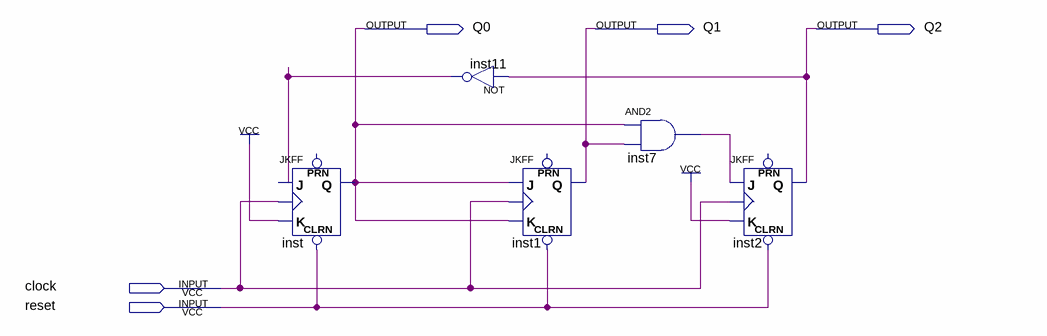
[diagram p0: schematic sheet]
// Quartus schematic Numaratormodulo5.bdf as structural Verilog: 5 symbols, 5 pins
module Numaratormodulo5 (
  input  clock,
  input  reset,
  output Q0,
  output Q1,
  output Q2
);

  wire inst7_out, inst11_out;

  JKFF inst (.CLRN(reset), .K(1'b1), .J(inst11_out), .CLK(clock), .Q(Q0));  // open: PRN
  not inst11 (inst11_out, Q2);
  JKFF inst1 (.CLRN(reset), .K(Q0), .J(Q0), .CLK(clock), .Q(Q1));  // open: PRN
  and inst7 (inst7_out, Q0, Q1);
  JKFF inst2 (.CLRN(reset), .K(1'b1), .J(inst7_out), .CLK(clock), .Q(Q2));  // open: PRN
endmodule
